# Altium schematic sheet DCDC.SchDoc
size A
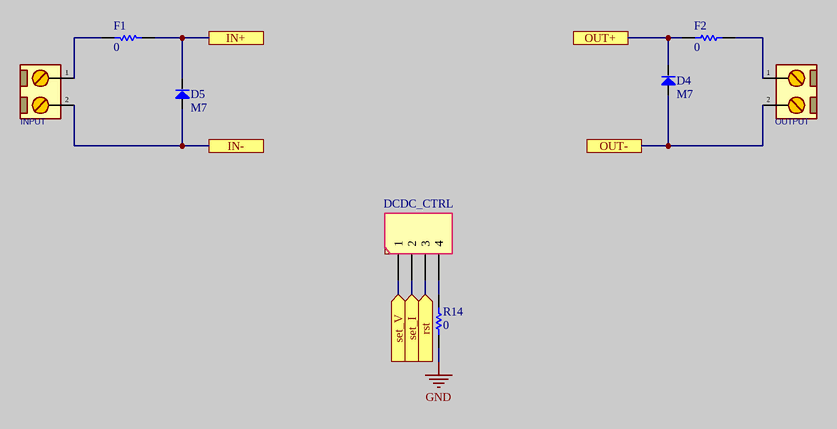
[diagram p0: DCDC.SchDoc]

## Parts
D4  M7  [FastDiode]
D5  M7  [FastDiode]
DCDC_CTRL  Header1*4  [HEADER1*4]  (value not drawn)
F1  0  [RES1206]
F2  0  [RES1206]
INPUT  CONN_TB8  [terminal block - 2828372]  (value not drawn)
OUTPUT  CONN_TB8  [terminal block - 2828372]  (value not drawn)
R14  0  [RESC0603]

## Ports
IN+, IN-, OUT+, OUT-, rst (in), set_I (in), set_V (in)

## Nets
GND: R14.1
IN+: D5.2(K) F1.1 ; port IN+
IN-: D5.1(A) INPUT.2 ; port IN-
OUT+: D4.2(K) F2.1 ; port OUT+
OUT-: D4.1(A) OUTPUT.2 ; port OUT-
rst: DCDC_CTRL.3 ; port rst
set_I: DCDC_CTRL.2 ; port set_I
set_V: DCDC_CTRL.1 ; port set_V
NetDCDC_CTRL_4: DCDC_CTRL.4 R14.2
NetF1_2: F1.2 INPUT.1
NetF2_2: F2.2 OUTPUT.1

## Library data of the parts
D4 D5 = FastDiode: Published: 8-Jun-2000; LatestRevisionDate: 17-Dec-2003; LatestRevisionNote: PCB Footprint replaced.; DatasheetDocument: 16-Apr-2002; PackageDocument: 16-Apr-2002; PackageReference: 3.5X2.8X1.9; Publisher: Altium Limited
DCDC_CTRL = Header1*4: Header, 4-Pin
F1 F2 R14 = Resistor: 0603,0.1W; Published: 8-Jun-2000; LatestRevisionDate: 17-Jul-2002; LatestRevisionNote: Re-released for DXP Platform.; PackageReference: AXIAL-0.5; Publisher: Altium Limited; Value: 0
INPUT OUTPUT = TERMINAL_BLOCK 1 × 2: CONN, TERMINAL BLOCK, 5.08mm pitch; VALUE: CONN_TB8